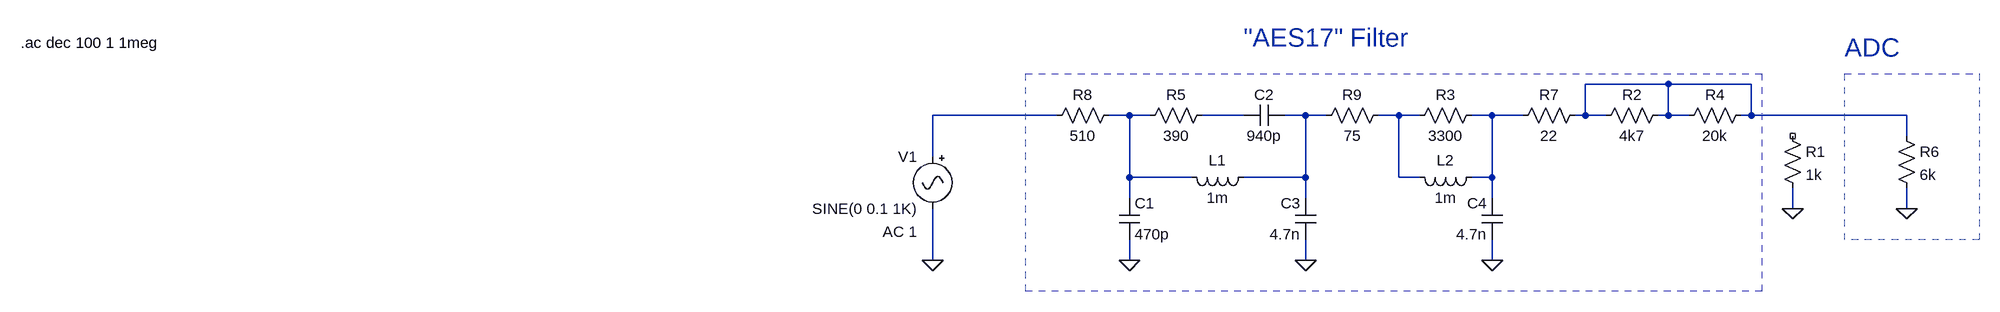
[diagram p0: schematic AES17Filter Frequency Domain.asc]
AES17Filter Frequency Domain.asc, the LTspice schematic file:
Version 4
SHEET 1 2936 680
WIRE 1392 -464 1264 -464
WIRE 1520 -464 1392 -464
WIRE 448 -416 256 -416
WIRE 560 -416 528 -416
WIRE 592 -416 560 -416
WIRE 736 -416 672 -416
WIRE 832 -416 800 -416
WIRE 864 -416 832 -416
WIRE 976 -416 944 -416
WIRE 1008 -416 976 -416
WIRE 1120 -416 1088 -416
WIRE 1168 -416 1120 -416
WIRE 1264 -416 1264 -464
WIRE 1264 -416 1248 -416
WIRE 1296 -416 1264 -416
WIRE 1392 -416 1392 -464
WIRE 1392 -416 1376 -416
WIRE 1424 -416 1392 -416
WIRE 1520 -416 1520 -464
WIRE 1520 -416 1504 -416
WIRE 1760 -416 1520 -416
WIRE 1760 -384 1760 -416
WIRE 256 -352 256 -416
WIRE 560 -320 560 -416
WIRE 656 -320 560 -320
WIRE 832 -320 832 -416
WIRE 832 -320 736 -320
WIRE 976 -320 976 -416
WIRE 1008 -320 976 -320
WIRE 1120 -320 1120 -416
WIRE 1120 -320 1088 -320
WIRE 560 -288 560 -320
WIRE 832 -288 832 -320
WIRE 1120 -288 1120 -320
WIRE 1584 -272 1584 -304
WIRE 1760 -272 1760 -304
WIRE 256 -192 256 -272
WIRE 560 -192 560 -224
WIRE 832 -192 832 -224
WIRE 1120 -192 1120 -224
FLAG 560 -192 0
FLAG 832 -192 0
FLAG 1120 -192 0
FLAG 1760 -272 0
FLAG 256 -192 0
FLAG 1584 -272 0
SYMBOL cap 544 -288 R0
SYMATTR InstName C1
SYMATTR Value 470p
SYMBOL cap 800 -432 R90
WINDOW 0 0 32 VBottom 2
WINDOW 3 32 32 VTop 2
SYMATTR InstName C2
SYMATTR Value 940p
SYMBOL ind 752 -336 R90
WINDOW 0 5 56 VBottom 2
WINDOW 3 32 56 VTop 2
SYMATTR InstName L1
SYMATTR Value 1m
SYMATTR SpiceLine Rser=1.4
SYMBOL cap 848 -224 R180
WINDOW 0 24 56 Left 2
WINDOW 3 24 8 Left 2
SYMATTR InstName C3
SYMATTR Value 4.7n
SYMBOL res 1104 -432 R90
WINDOW 0 0 56 VBottom 2
WINDOW 3 32 56 VTop 2
SYMATTR InstName R3
SYMATTR Value 3300
SYMBOL ind 1104 -336 R90
WINDOW 0 5 56 VBottom 2
WINDOW 3 32 56 VTop 2
SYMATTR InstName L2
SYMATTR Value 1m
SYMATTR SpiceLine Rser=1.4
SYMBOL cap 1136 -224 R180
WINDOW 0 24 56 Left 2
WINDOW 3 24 8 Left 2
SYMATTR InstName C4
SYMATTR Value 4.7n
SYMBOL res 688 -432 R90
WINDOW 0 0 56 VBottom 2
WINDOW 3 32 56 VTop 2
SYMATTR InstName R5
SYMATTR Value 390
SYMBOL res 1744 -400 R0
SYMATTR InstName R6
SYMATTR Value 6k
SYMBOL res 1264 -432 R90
WINDOW 0 0 56 VBottom 2
WINDOW 3 32 56 VTop 2
SYMATTR InstName R7
SYMATTR Value 22
SYMBOL res 544 -432 R90
WINDOW 0 0 56 VBottom 2
WINDOW 3 32 56 VTop 2
SYMATTR InstName R8
SYMATTR Value 510
SYMBOL res 960 -432 R90
WINDOW 0 0 56 VBottom 2
WINDOW 3 32 56 VTop 2
SYMATTR InstName R9
SYMATTR Value 75
SYMBOL Misc\\signal 256 -368 M0
WINDOW 123 24 132 Left 2
WINDOW 39 0 0 Left 0
SYMATTR Value2 AC 1
SYMATTR InstName V1
SYMATTR Value SINE(0 0.1 1K)
SYMBOL res 1568 -400 R0
SYMATTR InstName R1
SYMATTR Value 1k
SYMBOL res 1392 -432 R90
WINDOW 0 0 56 VBottom 2
WINDOW 3 32 56 VTop 2
SYMATTR InstName R2
SYMATTR Value 4k7
SYMBOL res 1520 -432 R90
WINDOW 0 0 56 VBottom 2
WINDOW 3 32 56 VTop 2
SYMATTR InstName R4
SYMATTR Value 20k
TEXT -1152 -528 Left 2 !.ac dec 100 1 1meg
TEXT 736 -536 Left 4 ;"AES17" Filter
TEXT 1664 -520 Left 4 ;ADC
RECTANGLE Normal 1536 -144 400 -480 2
RECTANGLE Normal 1872 -224 1664 -480 2

The netlist it stands for:
* AES17Filter Frequency Domain.asc
C1 N003 0 470p
C2 N005 N004 940p
L1 N005 N003 1m Rser=1.4
C3 0 N005 4.7n
R3 N007 N006 3300
L2 N007 N006 1m Rser=1.4
C4 0 N007 4.7n
R5 N004 N003 390
R6 N001 0 6k
R7 N001 N007 22
R8 N003 N002 510
R9 N006 N005 75
V1 N002 0 SINE(0 0.1 1K) AC 1
R1 NC_01 0 1k
R2 N001 N001 4k7
R4 N001 N001 20k
.ac dec 100 1 1meg
* "AES17" Filter
* ADC
.backanno
.end